# EAGLE design AmbaSat-06-SI1132-A10-GMR (EAGLE 9.3.2)
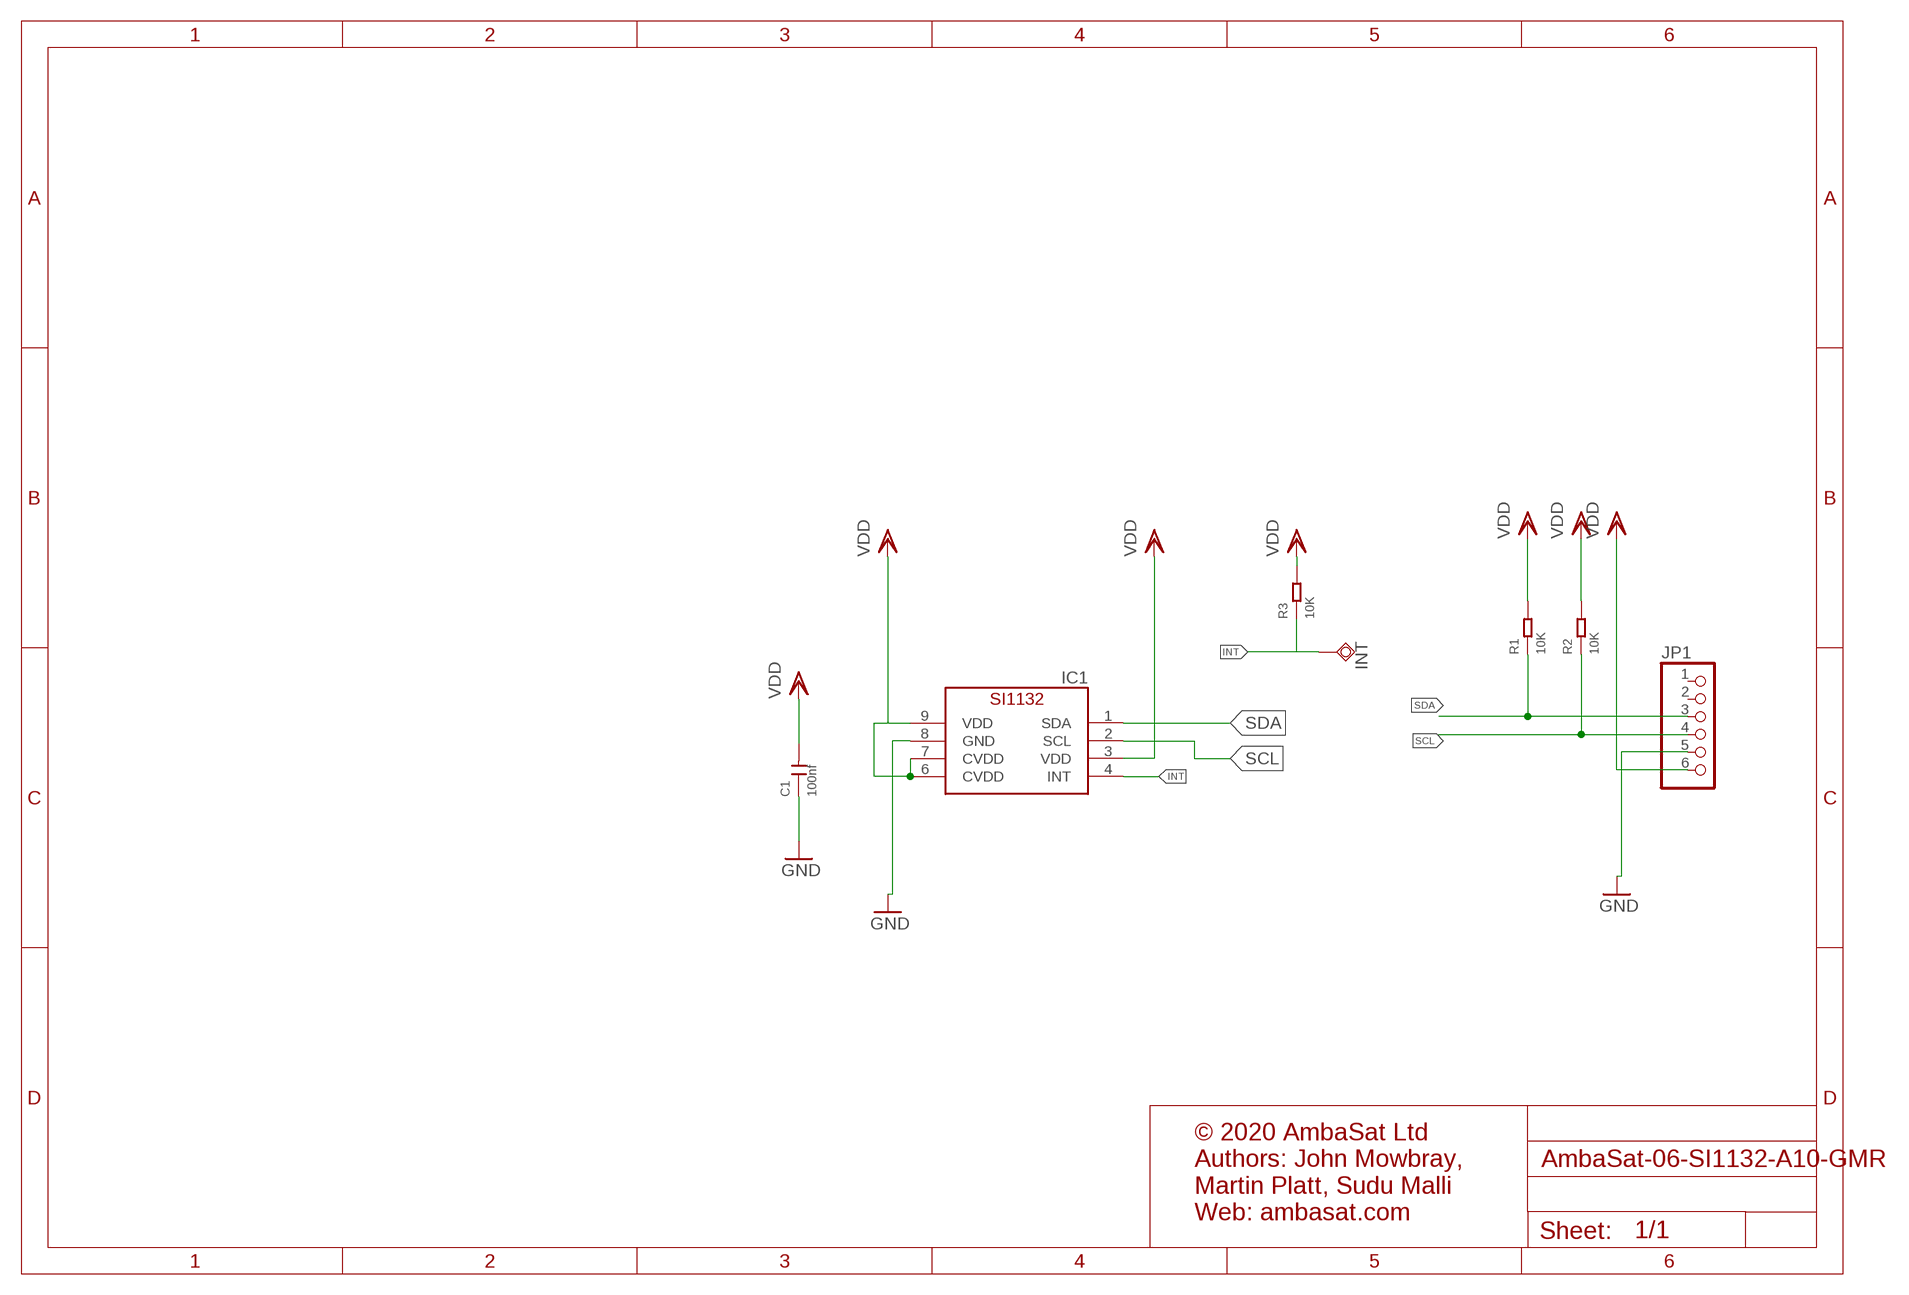
[diagram p0: schematic, sheet 1]

## Parts
C1  100nf  CERAMIC-100NF-50V-10%-X7R(0805)  [C0805]
IC1  SL-SI1132  [SILICONLABS-SI1132]
INT  TESTPAD_TPSQTP12R  [TESTPAD_TP12R]
JP1  HEADER-1X6  [1X06_OVAL]
R1  10K  SMD-RES-10K-1%-1/8W(0805)  [R0805]
R2  10K  SMD-RES-10K-1%-1/8W(0805)  [R0805]
R3  10K  SMD-RES-10K-1%-1/8W(0805)  [R0805]

## Nets
GND: C1.1 IC1.8(GND) JP1.5
INT: IC1.4(INT) INT.TP R3.1
SCL: IC1.2(SCL) JP1.4 R2.1
SDA: IC1.1(SDA) JP1.3 R1.1
VDD: C1.2 IC1.3(VDD) IC1.6(CVDD) IC1.7(CVDD) IC1.9(VDD) JP1.6 R1.2 R2.2 R3.2
Unconnected: JP1.1 JP1.2

## Notes on the sheet
- © 2020 AmbaSat Ltd
  Authors: John Mowbray, 
  Martin Platt, Sudu Malli
  Web: ambasat.com

## Library data of the parts
C1 = Seeed-Capacitor:CERAMIC-100NF-50V-10%-X7R(0805): 302010165; MPN: CC0805KRX7R9BB104
IC1 = FaBo-Mems:SL-SI1132: SiliconLabs SI1131(UV Index sensor)
INT = BeagleBone_Blue_R3:TESTPAD_TPSQ: Test pad
JP1 = microbuilder:HEADER-1X6: PIN HEADER
R1-R3 = Seeed-Resistor:SMD-RES-10K-1%-1/8W(0805): 301010361; MPN: RC0805FR-0710KL

## Board
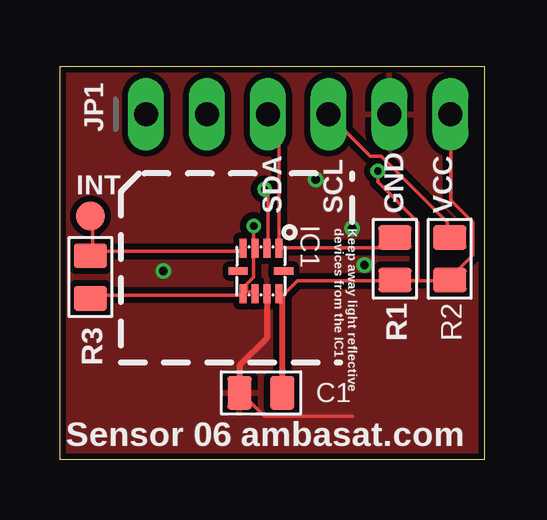
[diagram p1: board, top side]
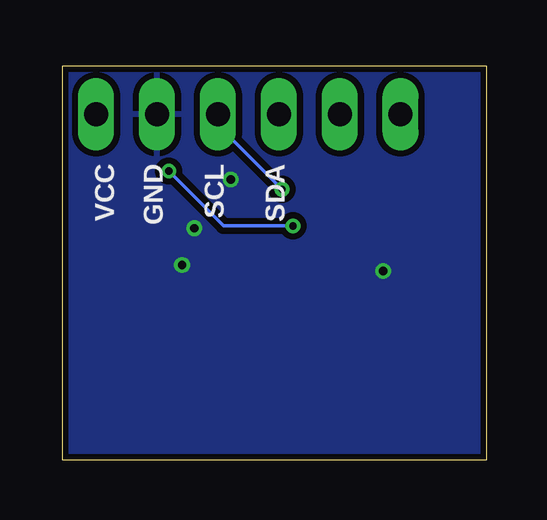
[diagram p2: board, bottom side, seen from below]

Size 17.7 x 16.4 mm. Coordinates in mm from the lower left corner, seen from the top.
Outline: 0,16.4 17.7,16.4 17.7,0 0,0 0,16.4
Copper layers (1*16): Top 0.035mm / dielectric 1.5mm / Bottom 0.035mm
Design rules "SeeedStudio_2layer_DRU_no_angle_20140221": minimum track width 6mil, minimum drill 12mil, track to track 6mil, track to pad 6mil, pad to pad 6mil, via to via 6mil, smd to smd 0mil, copper to edge 10mil, drill to drill 10mil, minimum pad ring 10mil, minimum via ring 6mil, stop-mask expansion 2mil, vias tented up to drill 100mil, thermal gap 10mil

### Footprints (pad centres in the part's own frame; a part is rotated, then mirrored left to right if it is on the bottom)
C0805 = smd 1.397 x 1.016: 1 0,0.889; 2 0,-0.889
SILICONLABS-SI1132 = smd 0.8 x 0.3: 1 -0.95,0.75; 2 -0.95,0.25; 3 -0.95,-0.25; 4 -0.95,-0.75; 6 0.95,-0.75; 7 0.95,-0.25; 8 0.95,0.25; 9 0.95,0.75 | smd 0.3 x 0.8: 5 0,-0.95; 10 0,0.95
TESTPAD_TP12R = smd 1.2 x 1.2: TP 0,0
1X06_OVAL = drill 1 long: 1 -6.35,0; 2 -3.81,0; 3 -1.27,0; 4 1.27,0; 5 3.81,0; 6 6.35,0
R0805 = smd 1.397 x 1.016: 1 0,0.889; 2 0,-0.889

### Placement (x,y rotation side)
C1  8.38,2.79 90 top
IC1  8.38,7.87 270 top
INT  1.27,10.16 0 top
JP1  9.94,14.4 0 top
R1  13.97,8.38 0 top
R2  16.26,8.38 0 top
R3  1.27,7.62 0 top

### Tracks (layer width: path | path; a pad name or v marks a point on that pad's centre or on a via)
GND  (via drill 0.35)
  Top 0.152: 12.19,1.83 8.53,1.83 7.62,2.74 C1.1
  Top 0.254: IC1.8 8.63,5.08 7.49,3.94 C1.1
  other vias: 10.67,11.68 12.19,9.65 12.7,8.13 4.32,7.87
  pour Top (isolate 0.254): 0,16.4 0,0 17.7,0 17.7,16.4
  pour Bottom (isolate 0.254): 0,16.4 0,0 17.7,0 17.7,16.4
INT
  Top 0.152: 1.37,8.53 1.52,8.69 7.62,8.69 IC1.4 | 1.37,8.53 1.37,10.06 INT.TP | 1.37,8.53 R3.1
SCL  (via drill 0.3)
  Top 0.152: v8.53,11.28 8.69,11.12 8.69,8.84 IC1.2 | R2.1 16.15,9.3 16.15,9.91 13.41,12.65 12.95,12.65 11.28,14.33 JP1.4
  Bottom 0.152: v8.53,11.28 11.12,13.87 11.12,14.33 JP1.4
SDA
  Top 0.152: 9.14,8.84 13.56,8.84 13.87,9.14 R1.1 | 9.14,8.84 9.14,13.87 8.69,14.33 JP1.3 | 9.14,8.84 IC1.1
VDD  (via drill 0.3)
  Top 0.152: 7.77,7.01 8.08,7.01 IC1.7 | 7.77,7.01 7.77,7.32 8.08,7.62 8.08,8.69 IC1.3 8.08,8.84 v8.08,9.75 | 7.77,7.01 IC1.6 7.62,6.86 1.37,6.86 R3.2 | 14.94,7.47 16.15,7.47 R2.2 16.31,7.62 17.22,8.53 17.22,9.91 16.31,10.82 16.31,14.33 JP1.6 | 14.94,7.47 14.02,7.47 R1.2 13.87,7.47 9.91,7.47 9.3,6.86 9.27,6.79 | v13.26,12.04 13.26,11.58 14.94,9.91 14.94,7.47
  Top 0.254: C1.2 9.27,6.79 IC1.9
  Bottom 0.152: v8.08,9.75 10.97,9.75 v13.26,12.04

### Text on the board
tPlace: SDA | Keep away light reflective / devices from the IC1 | SCL | GND | VCC | Sensor 06 ambasat.com
bPlace: SDA | SCL | GND | VCC